# Altium schematic sheet RJ45_Sheet.SchDoc
size 420 x 297 mm; SheetNumber: 7; SheetTotal: 9
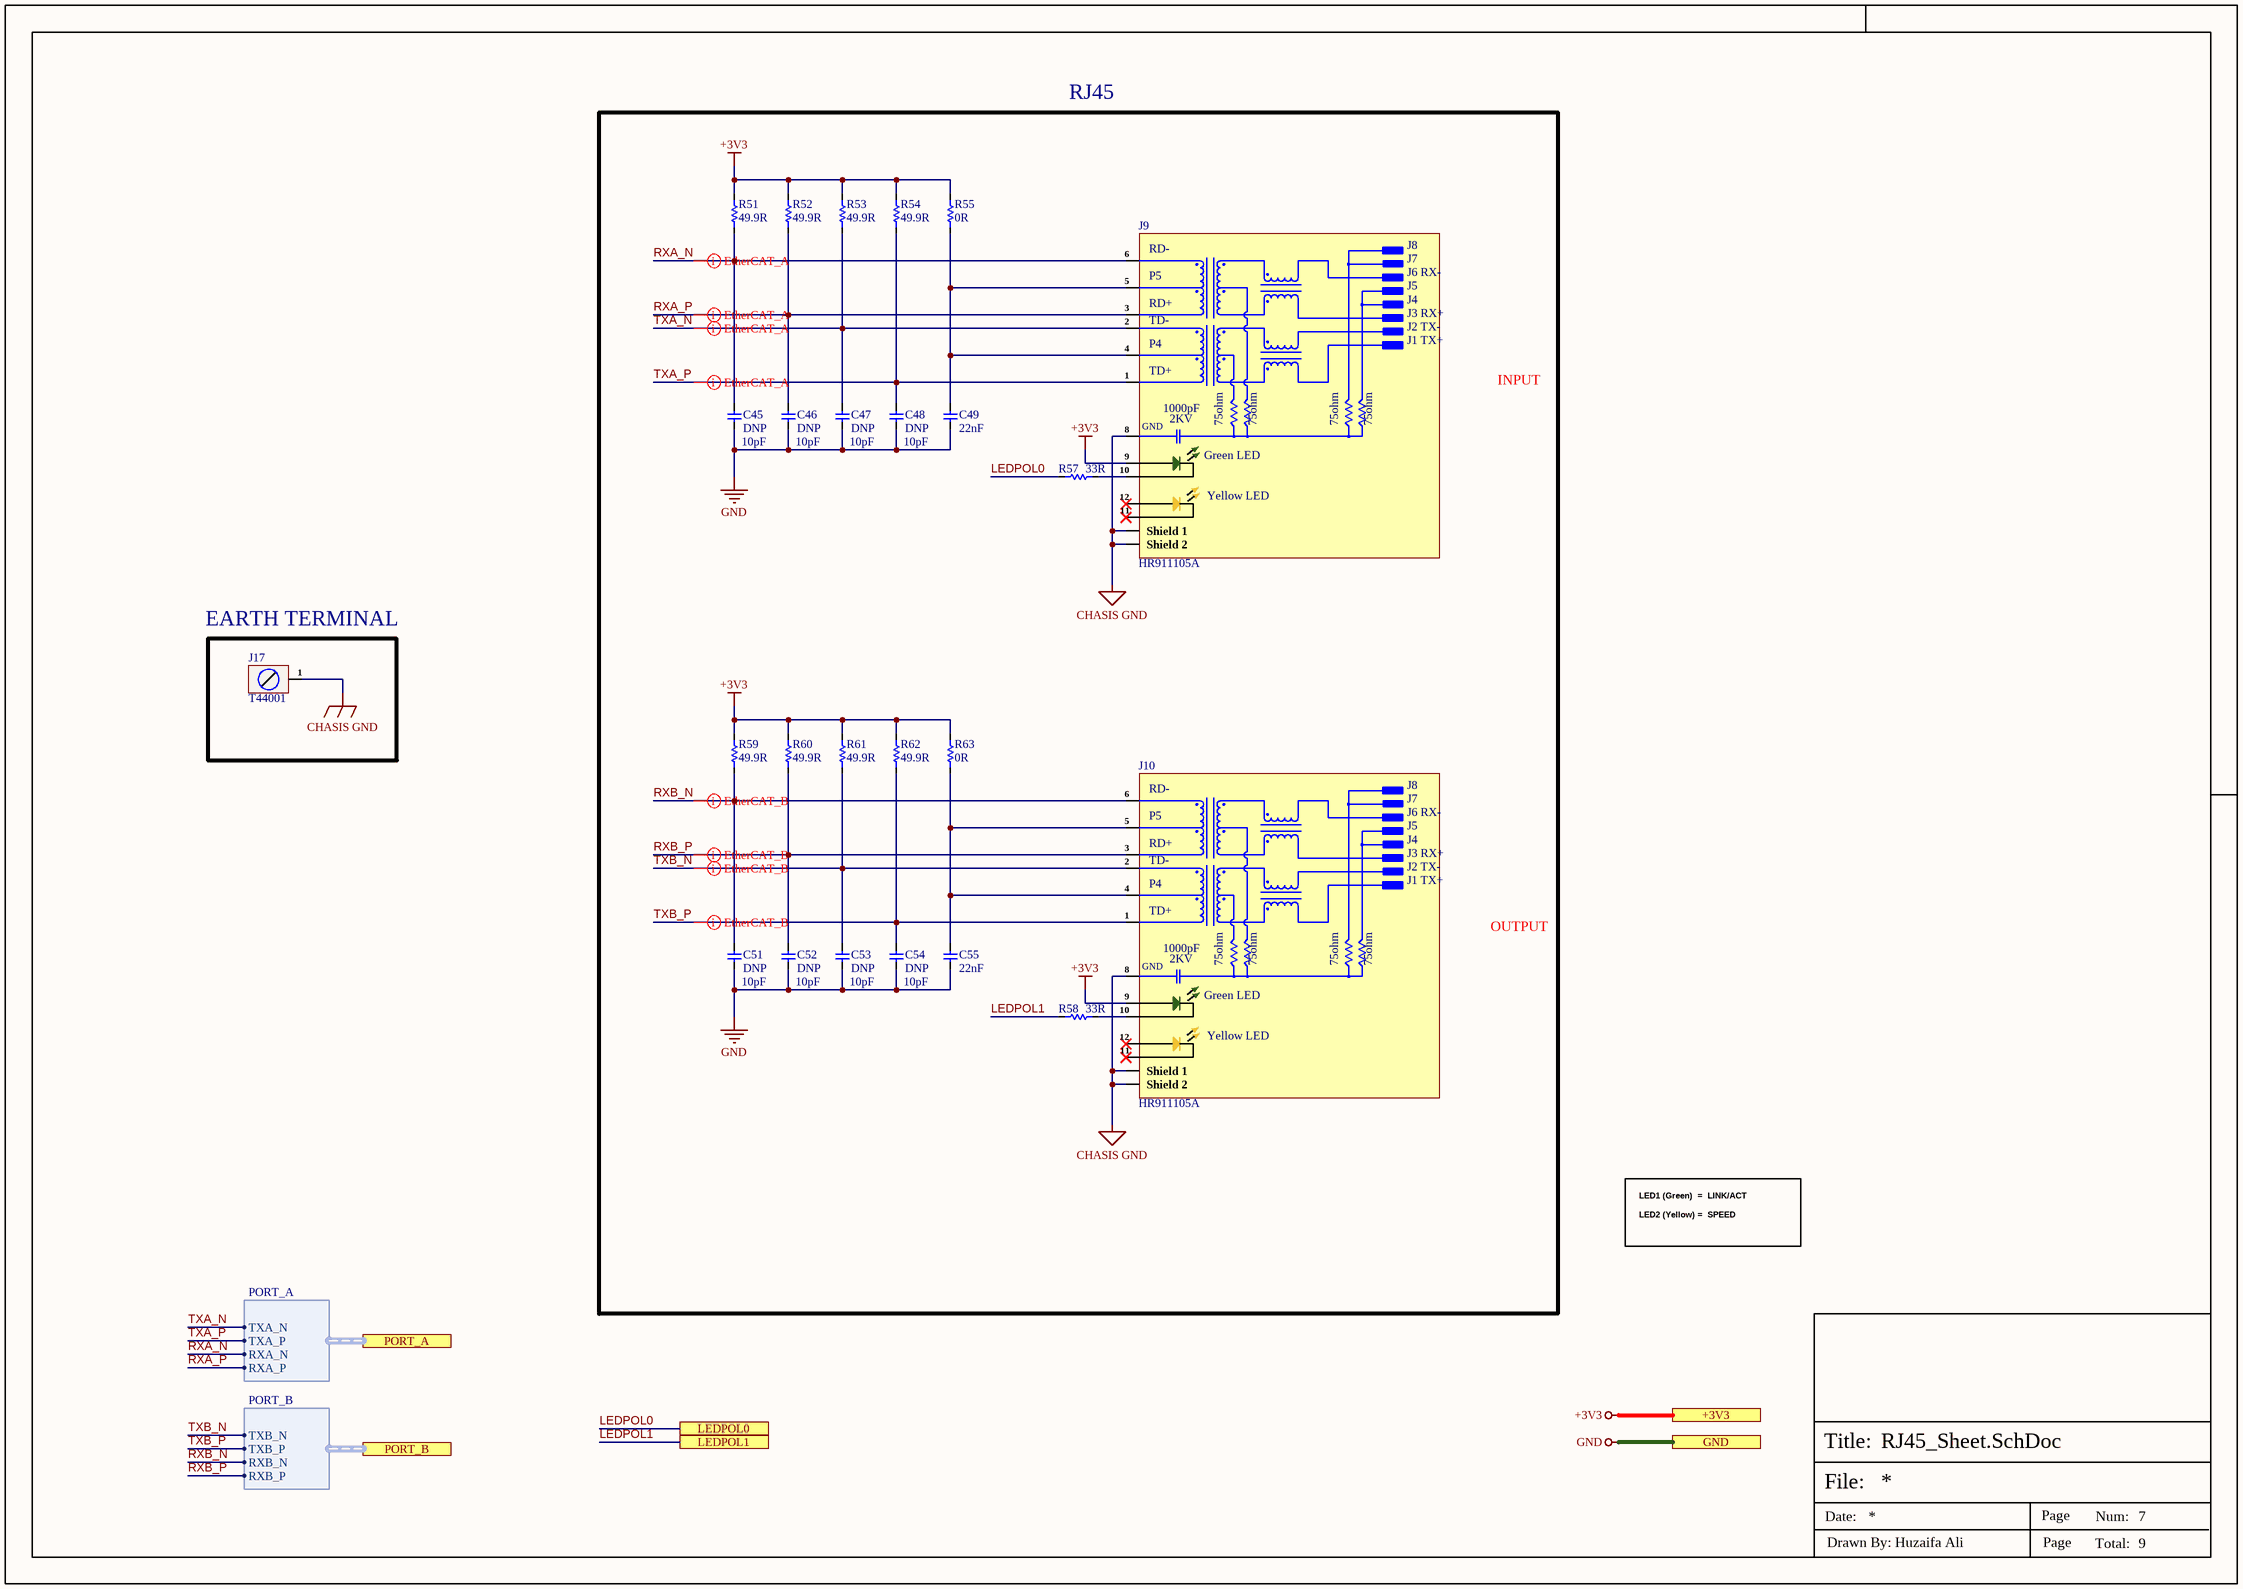
[diagram p0: RJ45_Sheet.SchDoc]

## Parts
C45  DNP  [Cap-0402]
C46  DNP  [Cap-0402]
C47  DNP  [Cap-0402]
C48  DNP  [Cap-0402]
C49  22nF  [Cap-0402]
C51  DNP  [Cap-0402]
C52  DNP  [Cap-0402]
C53  DNP  [Cap-0402]
C54  DNP  [Cap-0402]
C55  22nF  [Cap-0402]
J9  HR911105A  [HR911105A]
J10  HR911105A  [HR911105A]
J17  T44001  [T44001]
R51  49.9R  [Res-0603]
R52  49.9R  [Res-0603]
R53  49.9R  [Res-0603]
R54  49.9R  [Res-0603]
R55  0R  [Res-0402]
R57  33R  [Res-0402]
R58  33R  [Res-0402]
R59  49.9R  [Res-0603]
R60  49.9R  [Res-0603]
R61  49.9R  [Res-0603]
R62  49.9R  [Res-0603]
R63  0R  [Res-0402]

## Ports
+3V3 (see Top_Sheet[2C], CAN_Sheet[5D], Connector_Sheet[5D], Controller_Sheet[5D], EtherCAT_Sheet[5D], Power_Sheet[5D], RS485_RS232_Sheet[5D]), GND (see Top_Sheet[2C], CAN_Sheet[5D], Connector_Sheet[5D], Controller_Sheet[5D], EtherCAT_Sheet[5D], MOSFET_Sheet[5D], Power_Sheet[5D], RS485_RS232_Sheet[5D]), LEDPOL0 (see Top_Sheet[2C], EtherCAT_Sheet[2D]), LEDPOL1 (see Top_Sheet[2C], EtherCAT_Sheet[2D]), PORT_A (harness PORT_A, see Top_Sheet[2C], EtherCAT_Sheet[3D]), PORT_B (harness PORT_B, see Top_Sheet[2C], EtherCAT_Sheet[3D])

## Harnesses
PORT_A: TXA_N, TXA_P, RXA_N, RXA_P
PORT_B: TXB_N, TXB_P, RXB_N, RXB_P

## Nets
+3V3: J9.9(ANODE) J10.9(ANODE) R51.2 R52.2 R53.2 R54.2 R55.2 R59.2 R60.2 R61.2 R62.2 R63.2 ; port +3V3
CHASIS GND: J9.8(GND) J9.Shield_1 J9.Shield_2 J10.8(GND) J10.Shield_1 J10.Shield_2 J17.1
GND: C45.1 C46.1 C47.1 C48.1 C49.1 C51.1 C52.1 C53.1 C54.1 C55.1 ; port GND
LEDPOL0: R57.1 ; port LEDPOL0
LEDPOL1: R58.1 ; port LEDPOL1
RXA_N: C45.2 J9.6(RD-) R51.1 ; port PORT_A.RXA_N
RXA_P: C46.2 J9.3(RD+) R52.1 ; port PORT_A.RXA_P
RXB_N: C51.2 J10.6(RD-) R59.1 ; port PORT_B.RXB_N
RXB_P: C52.2 J10.3(RD+) R60.1 ; port PORT_B.RXB_P
TXA_N: C47.2 J9.2(TD-) R53.1 ; port PORT_A.TXA_N
TXA_P: C48.2 J9.1(TD+) R54.1 ; port PORT_A.TXA_P
TXB_N: C53.2 J10.2(TD-) R61.1 ; port PORT_B.TXB_N
TXB_P: C54.2 J10.1(TD+) R62.1 ; port PORT_B.TXB_P
NetC49_2: C49.2 J9.4(P4) J9.5(P5) R55.1
NetC55_2: C55.2 J10.4(P4) J10.5(P5) R63.1
NetJ9_10: J9.10(CATHODE) R57.2
NetJ10_10: J10.10(CATHODE) R58.2

Not connected (* = marked no-connect by the designer): J9 11(CATHODE)* 12(ANODE_)*; J10 11(CATHODE)* 12(ANODE_)*

## Layout directives
differential pair; differential pair class EtherCAT_B_Lines; net class EtherCAT_B; rule Matched Net Lengths [Tolerance = 25.4mil]; rule Impedance Constraint [Min = 85.00    Max = 95.00    ]: RXB_N, RXB_P, TXB_N, TXB_P
differential pair; differential pair class EtherCAT_A_Lines; net class EtherCAT_A; rule Matched Net Lengths [Tolerance = 25.4mil]; rule Impedance Constraint [Min = 85.00    Max = 95.00    ]: RXA_N, RXA_P, TXA_N, TXA_P

## Notes on the sheet
- RJ45
- INPUT
- 10pF
- (near J17) EARTH TERMINAL
- OUTPUT
- LED1 (Green)  =  LINK/ACT
  LED2 (Yellow) =  SPEED
- File:
- Title:
- Date:
- Page
- Num:
- Total:
- Drawn By: Huzaifa Ali
- (in symbol HR911105A) J8; J7; J6 RX-; J5; J4; J3 RX+; J2 TX-; J1 TX+; 1000pF; 2KV; 75ohm; Green LED; Yellow LED

## Library data of the parts
C45-C48 C51-C54 = GRM1555C1H100JA01D: CAP CER 10PF 50V C0G/NP0 0402; Manufacturer: Murata; Material: Ceramic; Dielectric: C0G; Tolerance: 5%; Item Type: Capacitor; Supplier: Arrow Electronics; Supplier Part Number: GRM1555C1H100JA01D; Manufacturer Part Number: GRM1555C1H100JA01D; RoHS: Yes; Category: Ceramic Capacitors; Stock: 3860000; Pricing: 10000=0.0034, 50000=0.0027, 100000=0.0023, 250000=0.0021 (USD); Mounting Technology: Surface Mount; Case/Package: 0402; Case Code (Metric): 1005; Case Code (Imperial): 0402; Min Operating Temperature: -55°C; Max Operating Temperature: 125°C; Value: 10pF; Voltage Rating: 50V; Packaging: Tape and Reel; Package Quantity: 1; Voltage Rating (DC): 50V; Termination: SMD/SMT; Series: GRM; Voltage: 50V; Construction: Flat; Length: 1mm; Width: 0.02inch; Height: 0.5mm; Depth: 0.5mm; Thickness: 0.022inch; Radiation Hardening: No; RoHS Compliant: Yes; Lead Free: Lead Free; Reach SVHC Compliant: No; ComponentLink1URL: https://datasheet.ciiva.com/2989/product-2989280.pdf?src-supplier=Avnet; ComponentLink1Description: https://datasheet.ciiva.com/2989/product-2989280.pdf?src-supplier=Avnet; ComponentLink2URL: https://datasheet.ciiva.com/18184/getdatasheetpartid-307234-18184164.pdf?src-supplier=Verical; ComponentLink2Description: https://datasheet.ciiva.com/18184/getdatasheetpartid-307234-18184164.pdf?src-supplier=Verical; ComponentLink3URL: https://datasheet.ciiva.com/29200/453545-da-01-en-vs-kondensator-0402-29200107.pdf?src-supplier=Conrad; ComponentLink3Description: https://datasheet.ciiva.com/29200/453545-da-01-en-vs-kondensator-0402-29200107.pdf?src-supplier=Conrad; ComponentLink4URL: https://datasheet.ciiva.com/7828/1666664-7828812.pdf?src-supplier=Element14; ComponentLink4Description: https://datasheet.ciiva.com/7828/1666664-7828812.pdf?src-supplier=Element14; ComponentLink5URL: https://datasheet.ciiva.com/6271/partnumbering-e-01-6271159.pdf?src-supplier=Digi-Key; ComponentLink5Description: https://datasheet.ciiva.com/6271/partnumbering-e-01-6271159.pdf?src-supplier=Digi-Key; ComponentLink6URL: https://datasheet.ciiva.com/6271/partnumbering-e-01-6271158.pdf?src-supplier=Digi-Key; ComponentLink6Description: https://datasheet.ciiva.com/6271/partnumbering-e-01-6271158.pdf?src-supplier=Digi-Key; ComponentLink7URL: https://datasheet.ciiva.com/6271/partnumbering-e-01-6271068.pdf?src-supplier=Digi-Key; ComponentLink7Description: https://datasheet.ciiva.com/6271/partnumbering-e-01-6271068.pdf?src-supplier=Digi-Key; LCSC Part Number: C76946
C49 C55 = CC0402JRX7R7BB223: CAP CER 0.022UF 16V X7R 0402; Manufacturer: Yageo; Tolerance: 5%; Item Type: Capacitor; Supplier: Digikey; Supplier Part Number: 311-3758-1-ND; Manufacturer Part Number: CC0402JRX7R7BB223; RoHS: Yes; Category: Ceramic Capacitors; Stock: 4203; Pricing: 1=0.1, 10=0.033, 50=0.0192, 100=0.0149, 500=0.0112, 1000=0.0088, 2500=0.008, 5000=0.00736 (USD); Mounting Technology: Surface Mount; Case/Package: 0402; Case Code (Imperial): 0402; Case Code (Metric): 1005; Weight: 2.3E-05oz; Min Operating Temperature: -55°C; Max Operating Temperature: 125°C; Value: 22nF; Packaging: Tape and Reel; Voltage Rating: 16V; Voltage Rating (DC): 16V; Dielectric: X7R; Termination: SMD/SMT; Series: CC; Length: 0.039inch; Width: 0.5mm; Thickness: 0.022inch; RoHS Compliant: Yes; Halogen Free: 5694HalogenFree; Lead Free: 5697LeadFree; ComponentLink1URL: https://datasheet.ciiva.com/13264/upy-gphc-x7r-6-3v-to-50v-8-12304-13264039.pdf?src-supplier=Mouser; ComponentLink1Description: https://datasheet.ciiva.com/13264/upy-gphc-x7r-6-3v-to-50v-8-12304-13264039.pdf?src-supplier=Mouser; LCSC Part Number: C541459
J9 J10 = HR911105A: RJ45 RJReceptacle 1 WithLED Plugin Ethernet Connectors/Modular Connectors (RJ45 RJ11) ROHS; Manufacturer: HANRUN; Item Type: RJ45 Connector; Manufacturer Part Number: HR911105A; Package: Plugin; LCSC Part Number: C12074; ComponentLink1Description: LCSC; ComponentLink1URL: https://www.lcsc.com/product-detail/Ethernet-Connectors-Modular-Connectors-RJ45-RJ11_HANRUN-Zhongshan-HanRun-Elec-HR911105A_C12074.html
J17 = T44001: M4 Plugin PCB Welding Terminal ROHS; Manufacturer: XFCN; Manufacturer Part Number: T44001; Package: Plugin; ComponentLink1Description: LCSC; ComponentLink1URL: *
R51-R54 R59-R62 = RC0603FR-0749R9L: RES 49.9 OHM 1% 1/10W 0603; Manufacturer: Yageo; Temperature Coefficient: 100ppm/°C; Voltage Rating (DC): 50V; Power Rating: 100mW; Item Type: Resistor; Supplier 1: Arrow Electronics; Manufacturer Part Number: RC0603FR-0749R9L; RoHS: Yes; Category: Chip SMD Resistors; Stock 1: 2075000; Pricing 1: 5000=0.00280 (USD); Case/Package: 0603; Number of Pins: 2; Case Code (Imperial): 0603; Case Code (Metric): 1608; Size Code: 0603; Min Operating Temperature: -55°C; Max Operating Temperature: 155°C; Tolerance: 1%; Resistance: 49.9R; Resistor Type: Thick Film; Packaging: Tape and Reel; Voltage Rating: 50V; Termination: SMD/SMT; Features: Moisture Resistant; Series: RC; Max Power Dissipation: 100mW; Number of Terminations: 2; Construction: Rectangular; Resistance Tolerance: 1%; Technology: THICK FILM; Length: 1.6mm; Height: 0.45mm; Depth: 0.8mm; Lead Free: Lead Free; REACH SVHC: No SVHC; Military Standard: Not; RoHS Compliant: Yes; ComponentLink1URL: https://datasheet.ciiva.com/11808/0900766b80f96399-11808223.pdf?src-supplier=RSComponents; ComponentLink1Description: https://datasheet.ciiva.com/11808/0900766b80f96399-11808223.pdf?src-supplier=RSComponents; ComponentLink2URL: https://datasheet.ciiva.com/22747/443971-22747527.pdf?src-supplier=Element14; ComponentLink2Description: https://datasheet.ciiva.com/22747/443971-22747527.pdf?src-supplier=Element14; ComponentLink3URL: https://datasheet.ciiva.com/15189/getdatasheetpartid-325421-15189750.pdf?src-supplier=Verical; ComponentLink3Description: https://datasheet.ciiva.com/15189/getdatasheetpartid-325421-15189750.pdf?src-supplier=Verical; Supplier Part Number 1: RC0603FR-0749R9L; LCSC Part Number: C114625
R55 R63 = AC0402FR-070RL: RESISTOR 0402 JUMPER ZERO OHM; Manufacturer: Yageo; Voltage Rating: 50V; Power Rating: 62.5mW; Tolerance: 1%; Temperature Coefficient: 200ppm/°C; Supplier: Digi-Key; Supplier Part Number: 13-AC0402FR-070RLDKR-ND; Manufacturer Part Number: AC0402FR-070RL; RoHS: Yes; Category: Chip SMD Resistors; Stock: 337140; Pricing: 1=0.1, 10=0.017, 25=0.0132, 50=0.01, 100=0.0071, 250=0.00568, 500=0.00454, 1000=0.00335, 5000=0.0024 (USD); Case/Package: 0402; Case Code (Imperial): 0402; Case Code (Metric): 1005; Min Operating Temperature: -55°C; Max Operating Temperature: 155°C; Value: 0R; Packaging: Tape and Reel; Termination: SMD/SMT; Series: AC; Height: 370um; ComponentLink1URL: https://datasheet.ciiva.com/12656/pyu-ac-51-rohs-l-2-12656734.pdf?src-supplier=Mouser; ComponentLink1Description: https://datasheet.ciiva.com/12656/pyu-ac-51-rohs-l-2-12656734.pdf?src-supplier=Mouser; LCSC Part Number: C226739; Item Type: Resistor; ComponentLink2Description: LCSC; ComponentLink2URL: https://www.lcsc.com/product-detail/Chip-Resistor-Surface-Mount_YAGEO-AC0402FR-070RL_C226739.html
R57 R58 = RC0402FR-0733RL: RES 33 OHM 1% 1/16W 0402; Manufacturer: Yageo; Power Rating: 62.5mW; Voltage Rating: 50V; Temperature Coefficient: 100ppm/°C; Max Power Dissipation: 63mW; Supplier 1: Mouser; Manufacturer Part Number: RC0402FR-0733RL; RoHS: Yes; Category: Chip SMD Resistors; Stock 1: 1843488; Pricing 1: 1=0.10000, 10=0.01200, 50=0.01200, 100=0.00500, 1000=0.00300, 10000=0.00100 (USD); Case/Package: 0402; Number of Pins: 2; Case Code (Imperial): 0402; Case Code (Metric): 1005; Size Code: 0402; Min Operating Temperature: -55°C; Max Operating Temperature: 155°C; Resistor Type: Thick Film; Resistance: 33R; Tolerance: 1%; Packaging: Tape and Reel; Voltage Rating (DC): 50V; Package Quantity: 10000; Termination: SMD/SMT; Features: Moisture Resistant; Series: RC; Number of Terminations: 2; Resistance Tolerance: 1%; Construction: Rectangular; Technology: THICK FILM; Length: 1mm; Width: 0.5mm; Height: 0.35mm; Depth: 0.5mm; RoHS Compliant: Yes; REACH SVHC: Unknown; Military Standard: Not; Lead Free: Lead Free; ComponentLink1URL: https://datasheet.ciiva.com/11819/0900766b80c66297-11819487.pdf?src-supplier=RSComponents; ComponentLink1Description: https://datasheet.ciiva.com/11819/0900766b80c66297-11819487.pdf?src-supplier=RSComponents; ComponentLink2URL: https://datasheet.ciiva.com/24070/pyu-rc0402-51-rohs-l-6-r-8721-24070077.pdf?src-supplier=Mouser; ComponentLink2Description: https://datasheet.ciiva.com/24070/pyu-rc0402-51-rohs-l-6-r-8721-24070077.pdf?src-supplier=Mouser; ComponentLink3URL: https://datasheet.ciiva.com/7849/1018594-7849967.pdf?src-supplier=Element14; ComponentLink3Description: https://datasheet.ciiva.com/7849/1018594-7849967.pdf?src-supplier=Element14; ComponentLink4URL: https://datasheet.ciiva.com/7849/1018594-7849966.pdf?src-supplier=Element14; ComponentLink4Description: https://datasheet.ciiva.com/7849/1018594-7849966.pdf?src-supplier=Element14; ComponentLink5URL: https://datasheet.ciiva.com/15189/getdatasheetpartid-329253-15189431.pdf?src-supplier=Verical; ComponentLink5Description: https://datasheet.ciiva.com/15189/getdatasheetpartid-329253-15189431.pdf?src-supplier=Verical; ComponentLink6URL: https://datasheet.ciiva.com/17070/pyu-rc0402-51-rohs-l-6-r-17070335.pdf?src-supplier=Future+Electronics; ComponentLink6Description: https://datasheet.ciiva.com/17070/pyu-rc0402-51-rohs-l-6-r-17070335.pdf?src-supplier=Future+Electronics; Supplier Part Number 1: 603-RC0402FR-0733RL; LCSC Part Number: C138002